# Altium schematic sheet power.SchDoc
size A3; DocumentNumber: 2; SheetTotal: 4
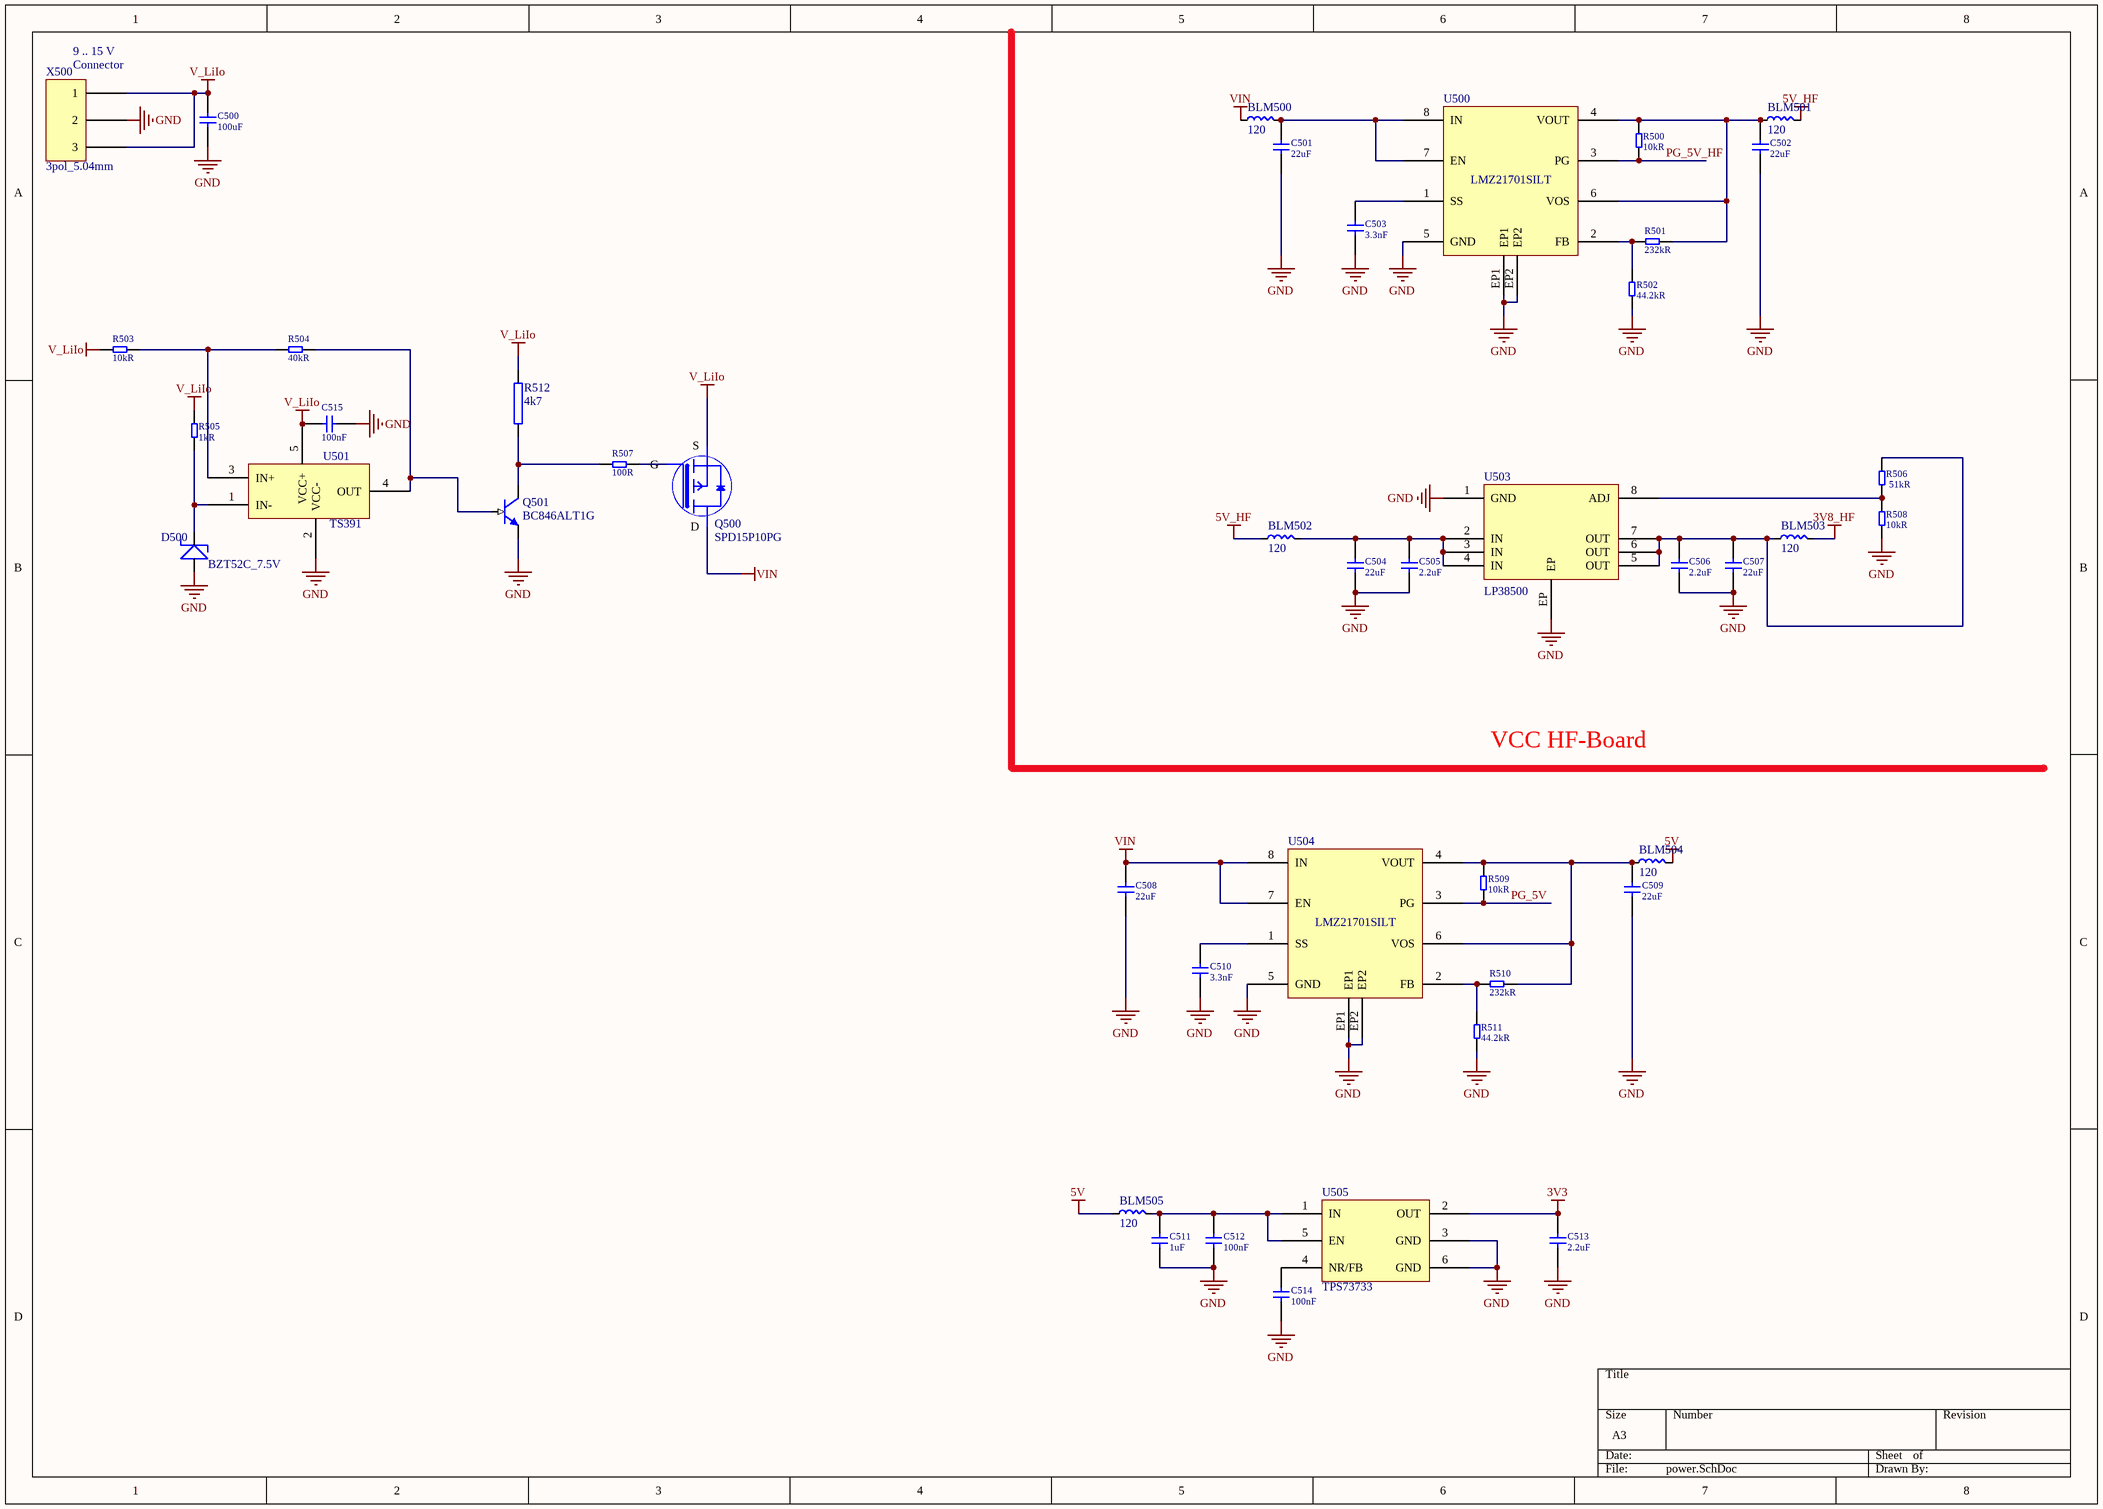
[diagram p0: power.SchDoc]

## Parts
BLM500  FerriteBeat  [BLM18SG121TN1]  (value not drawn)
BLM501  FerriteBeat  [BLM18SG121TN1]  (value not drawn)
BLM502  FerriteBeat  [BLM18SG121TN1]  (value not drawn)
BLM503  FerriteBeat  [BLM18SG121TN1]  (value not drawn)
BLM504  FerriteBeat  [BLM18SG121TN1]  (value not drawn)
BLM505  FerriteBeat  [BLM18SG121TN1]  (value not drawn)
C500  value 100uF  [C_SMD_1210]  (hidden comment: SMD capacitor)
C501  value 22uF  [C_SMD_0805]  (hidden comment: SMD capacitor)
C502  value 22uF  [C_SMD_0805]  (hidden comment: SMD capacitor)
C503  value 3.3nF  [C_SMD_0402]  (hidden comment: SMD capacitor)
C504  value 22uF  [C_SMD_0805]  (hidden comment: SMD capacitor)
C505  value 2.2uF  [C_SMD_0603]  (hidden comment: SMD capacitor)
C506  2.2uF  [C_SMD_0603]
C507  value 22uF  [C_SMD_0805]  (hidden comment: SMD capacitor)
C508  value 22uF  [C_SMD_0805]  (hidden comment: SMD capacitor)
C509  value 22uF  [C_SMD_0805]  (hidden comment: SMD capacitor)
C510  value 3.3nF  [C_SMD_0402]  (hidden comment: SMD capacitor)
C511  value 1uF  [C_SMD_0603]  (hidden comment: SMD capacitor)
C512  value 100nF  [C_SMD_0402]  (hidden comment: SMD capacitor)
C513  value 2.2uF  [C_SMD_0603]  (hidden comment: SMD capacitor)
C514  value 100nF  [C_SMD_0402]  (hidden comment: SMD capacitor)
C515  value 100nF  [C_SMD_0402]  (hidden comment: SMD capacitor)
D500  BZT52C_7.5V  [SOD-323]
Q500  SPD15P10PG  [PG-TO-252-3]
Q501  BC846ALT1G  [SOT-23_BCE]
R500  value 10kR  [R_SMD_0402]  (hidden comment: SMD Resistor)
R501  value 232kR  [R_SMD_0402]  (hidden comment: SMD Resistor)
R502  value 44.2kR  [R_SMD_0402]  (hidden comment: SMD Resistor)
R503  value 10kR  [R_SMD_0402]  (hidden comment: SMD Resistor)
R504  value 40kR  [R_SMD_0402]  (hidden comment: SMD Resistor)
R505  value 1kR  [R_SMD_0402]  (hidden comment: SMD Resistor)
R506  51kR  [R_SMD_0402]
R507  value 100R  [R_SMD_0402]  (hidden comment: SMD Resistor)
R508  10kR  [R_SMD_0402]
R509  value 10kR  [R_SMD_0402]  (hidden comment: SMD Resistor)
R510  value 232kR  [R_SMD_0402]  (hidden comment: SMD Resistor)
R511  value 44.2kR  [R_SMD_0402]  (hidden comment: SMD Resistor)
R512  4k7  [0402RN]
U500  LMZ21701SILT  [LMZ21701]
U501  TS391  [SOT-23-5]
U503  LP38500  [LP38500]
U504  LMZ21701SILT  [LMZ21701]
U505  TPS73733  [SOT-223-6]
X500  3pol_5.04mm  [POWER_CON]

## Nets
3V3: C513.1 U505.2(OUT)
3V8_HF: BLM503.1
5V: BLM504.1 BLM505.2
5V_HF: BLM501.1 BLM502.2
GND: C500.2 C501.2 C502.2 C503.2 C504.2 C505.2 C506.1 C507.1 C508.2 C509.2 C510.2 C511.2 C512.2 C513.2 C514.2 C515.2 D500.2 Q501.E R502.2 R508.2 R511.2 U500.5(GND) U500.EP1 U500.EP2 U501.2(VCC-) U503.1(GND) U503.EP U504.5(GND) U504.EP1 U504.EP2 U505.3(GND) U505.6(GND) X500.2
V_LiIo: C500.1 C515.1 Q500.3(S) R503.1 R505.1 R512.2 U501.5(VCC+) X500.1 X500.3
VIN: BLM500.2 C508.1 Q500.2(D) U504.7(EN) U504.8(IN)
PG_5V: R509.2 U504.3(PG)
PG_5V_HF: R500.2 U500.3(PG)
NetBLM500_1: BLM500.1 C501.1 U500.7(EN) U500.8(IN)
NetBLM501_2: BLM501.2 C502.1 R500.1 R501.2 U500.4(VOUT) U500.6(VOS)
NetBLM502_1: BLM502.1 C504.1 C505.1 U503.2(IN) U503.3(IN) U503.4(IN)
NetBLM503_2: BLM503.2 C506.2 C507.2 R506.1 U503.5(OUT) U503.6(OUT) U503.7(OUT)
NetBLM504_2: BLM504.2 C509.1 R509.1 R510.2 U504.4(VOUT) U504.6(VOS)
NetBLM505_1: BLM505.1 C511.1 C512.1 U505.1(IN) U505.5(EN)
NetC503_1: C503.1 U500.1(SS)
NetC510_1: C510.1 U504.1(SS)
NetC514_1: C514.1 U505.4(NR/FB)
NetD500_1: D500.1 R505.2 U501.1(IN-)
NetQ500_1: Q500.1(G) R507.1
NetQ501_B: Q501.B R504.2 U501.4(OUT)
NetQ501_C: Q501.C R507.2 R512.1
NetR501_1: R501.1 R502.1 U500.2(FB)
NetR503_2: R503.2 R504.1 U501.3(IN+)
NetR506_2: R506.2 R508.1 U503.8(ADJ)
NetR510_1: R510.1 R511.1 U504.2(FB)

## Notes on the sheet
- (near X500) 9 .. 15 V
- (near X500) Connector
- VCC HF-Board
- (in symbol FerriteBeat) 120

## Library data of the parts
BLM500-BLM505 = FerriteBeat: BLM18SG121TN1; Link: http://www.murata.com/en-us/api/pdfdownloadapi?cate=luNoiseSupprFilteChipFerriBead&partno=BLM18SG121TN1%23
C500 = C_SMD: 100uF, 1210, 25V, 20%, X5R; Type: X5R; Voltage Rate: *
C501 C508 = C_SMD: 22uF, 0805, 25V, 20%, X5R; Voltage Rate: 10V; Type: X5R
C502 C504 C507 C509 = C_SMD: 22uF, 0805, 10V, 20%, X5R; Type: X5R; Voltage Rate: 10V
C503 C510 = C_SMD: 3.3nF, 0402, 10V, 10%, X5R; Type: X5R; Voltage Rate: 10V
C505 C506 C513 = C_SMD: 2.2uF, 0603, 6.3V, 10%, X5R; Type: X5R; Voltage Rate: *
  C506: Value: 2.2uF
C511 = C_SMD: 1uF, 0603, 6.3V, 10%, X5R; Type: X5R; Voltage Rate: *
C512 C514 C515 = C_SMD: 100nF, 0402, 6.3V, 10%, X5R; Type: X5R; Voltage Rate: *
D500 = BZT52C: BZT52C7V5S-7-F
Q500 = SPD15P10PG: SPD15P10PGBTMA1, MOSFET P-CH 100V 15A TO252-3
Q501 = npn-Transistor - BC846ALT1G: BC846A; Ic 100mA; Uce 65V; NPN Transistor; Typ: Bipolartranistor Leistung; FIT: 3; Libary Name: bjt.SchLib; Hersteller: Semiconductor; Bauteilalternative: Diodes Inc: BC846A-7-F; DatenblattLink intern: O:\literature\datasheets\nxp\transistoren\MMBT3904\MMBT3904.pdf; Eingetragen von: MK; Part Number: npn-Transistor - BC846ALT1G; Source: SN29500-3, Tab. 1; Footprint Name: SOT-23.PcbLib; Footprint: SOT23; Bauteilenummer: BC846ALT1G; quantity Multiplier: 1; HelpURL: http://www.onsemi.com/pub_link/Collateral/BC846ALT1-D.PDF; DatenblattLink: http://www.onsemi.com/pub_link/Collateral/BC846ALT1-D.PDF; Distributor1: Digikey; Teilenummer Distributor1: BC846ALT1GOSCT-ND; Preis @100 Distributor1: 0,0837; Distributor2: Mouser; Teilenummer Distributor2: 863-BC846ALT1G; Preis @100 Distributor2: 0,04; Distributor3: Farnell; Teilenummer Distributor3: 1459036; Preis @100 Distributor3: 0,069
R500 R509 = R_SMD: 10kR, 0402, 1%
R501 R510 = R_SMD: 232kR, 0402, 1%
R502 R511 = R_SMD: 44.2kR, 0402, 1%
R503 = R_SMD: 10kR, 04020 ,1%
R504 = R_SMD: 40kR, 04020 ,1%
R505 = R_SMD: 1kR, 04020 ,1%
R506 = R_SMD: 43.2kR, 0402, 1%; Value: 51kR
R507 = R_SMD: 100R, 04020 ,1%
R508 = R_SMD: 8.25kR, 0402, 1%; Value: 10kR
R512 = 4k7, 0402, 1%, 0.063W, 50V: 1%, 0.063W, 50V, 0402; Typ: Widerstand Metallschicht; FIT: 0,2; Libary Name: _RES.Schlib; Eingetragen von: MK; Part Number: 4k7, 0402, 1%, 0.063W, 50V; Source: SN29500-4, Tabelle 2; Footprint Name: 0402RN.Pcblib; Footprint: 0402; quantity Multiplier: 1; Distributor1: Digikey; Preis @100 Distributor1: 0,0056
U500 U504 = LMZ21701
U501 = TS391: TS391RILT,   Comparator General Purpose TTL, DTL, ECL, MOS, CMOS SOT-23-5
U503 = LP38500: LP38502ASD-ADJ/NOPB
U505 = TPS73733: TPS73733DCQR
X500 = CON_5.04_3pol: 3 polig, 5.04mm pitch